# EAGLE design BATT_FLEX11 (EAGLE 9.6.2)
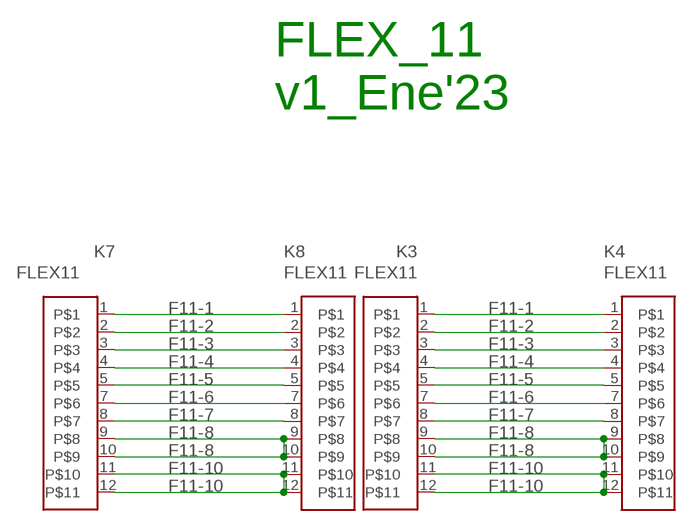
[diagram p0: schematic, sheet 1]

## Parts
K3  FLEX11  [FLEX11]
K4  FLEX11  [FLEX11]
K7  FLEX11  [FLEX11]
K8  FLEX11  [FLEX11]

## Nets
F11-1: K3.1 K4.1 K7.1 K8.1
F11-2: K3.2 K4.2 K7.2 K8.2
F11-3: K3.3 K4.3 K7.3 K8.3
F11-4: K3.4 K4.4 K7.4 K8.4
F11-5: K3.5 K4.5 K7.5 K8.5
F11-6: K3.7 K4.7 K7.7 K8.7
F11-7: K3.8 K4.8 K7.8 K8.8
F11-8: K3.9 K3.10 K4.9 K4.10 K7.9 K7.10 K8.9 K8.10
F11-10: K3.11 K3.12 K4.11 K4.12 K7.11 K7.12 K8.11 K8.12

## Notes on the sheet
- FLEX_11
  v1_Ene'23

## Library data of the parts
K3 K4 K7 K8 = Flex_3mm:FLEX11

## Board
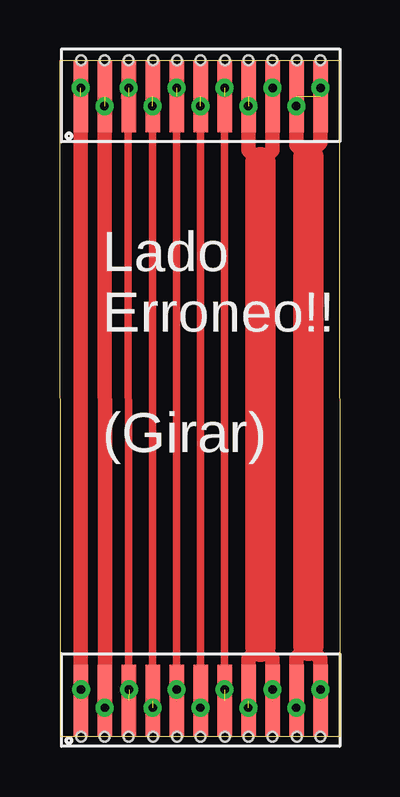
[diagram p1: board, top side]
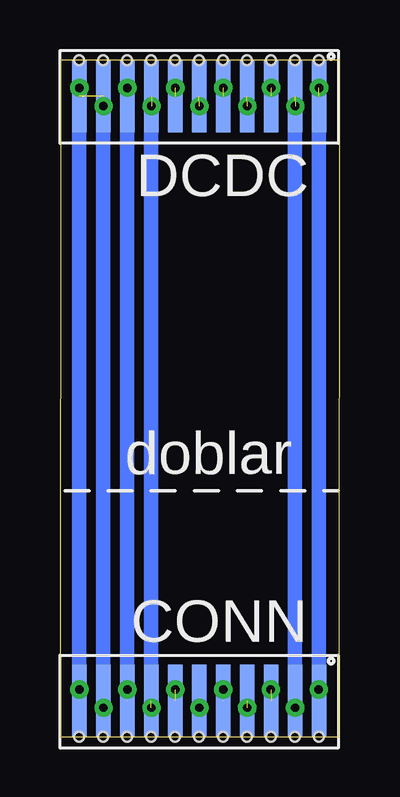
[diagram p2: board, bottom side, seen from below]

Size 11.68 x 28.2 mm. Coordinates in mm from the lower left corner, seen from the top.
Outline: 0,28.2 11.65,28.2 11.68,0 0.03,0 0,28.2
Copper layers (1*16): Top 0.035mm / dielectric 1.5mm / Bottom 0.035mm
Design rules "default *": minimum track width 6mil, minimum drill 0.35mm, track to track 6mil, track to pad 6mil, pad to pad 6mil, via to via 6mil, smd to smd 6mil, copper to edge 8mil, drill to drill 6mil, minimum pad ring 10mil, minimum via ring 8mil, stop-mask expansion 4mil, vias tented up to drill 50mil, thermal gap 10mil
Holes 0.4 mm at 0.88,0.01 1.87,0.01 2.87,0.01 3.88,0.01 4.88,0.01 5.87,0.01 6.88,0.01 7.87,0.01 0.88,28.2 1.87,28.2 2.87,28.2 3.88,28.2 4.88,28.2 5.87,28.2 6.88,28.2 7.87,28.2 8.87,28.2 9.88,28.2 10.87,28.2 8.87,0 9.88,0 10.87,0

### Footprints (pad centres in the part's own frame; a part is rotated, then mirrored left to right if it is on the bottom)
FLEX11 = smd 0.6 x 3: 1 0.8,2.05; 2 1.8,2.05; 3 2.8,2.05; 4 3.8,2.05; 5 4.8,2.05; 7 5.8,2.05; 8 6.8,2.05; 9 7.8,2.05; 10 8.8,2.05; 11 9.8,2.05; 12 10.8,2.05

### Placement (x,y rotation side)
K3  0.07,-0.55 0 top
K4  0.07,24.64 0 top
K7  0.07,28.75 180 bottom
K8  0.07,3.55 180 bottom

### Tracks (layer width: path | path; a pad name or v marks a point on that pad's centre or on a via)
F11-1  (via drill 0.35)  (2 unrouted)
  Top 0.406: K8.1 v0.88,1.97
  Top 0.61: 0.88,1.32 K8.1 K4.1
  Bottom 0.61: K7.1 v0.87,1.98 v0.88,1.97
  other vias: 0.87,27.04
F11-2  (via drill 0.35)  (2 unrouted)
  Top 0.406: K8.2 v1.88,1.22 v1.87,1.21
  Top 0.61: K8.2 K4.2
  Bottom 0.61: K7.2 K8.2
  other vias: 1.86,26.28
F11-3  (via drill 0.35)  (4 unrouted)
  Top 0.305: K8.3 2.85,26.67
  Top 0.61: K8.3 | K4.3 2.85,26.67
  Bottom 0.406: K8.3 | K4.3 K7.3
  other vias: 2.87,27.04 2.88,1.97
F11-4  (via drill 0.35)  (4 unrouted)
  Top 0.305: K4.4 v3.87,1.21
  Top 0.406: K8.4
  other vias: 3.86,26.28
F11-5  (via drill 0.35)  (3 unrouted)
  Top 0.305: K4.5 v4.87,1.97
  Top 0.406: K8.5 v4.87,1.97
  other vias: 4.87,27.04
F11-6  (via drill 0.35)  (3 unrouted)
  Top 0.305: 5.87,1.23 5.88,1.23 | K4.7 K8.7
  Top 0.406: K8.7 5.88,1.23 v5.86,1.21
  Bottom 0.61: v5.87,26.27 v5.86,26.28
F11-7  (via drill 0.35)  (4 unrouted)
  Top 0.305: K8.8 K4.8
  other vias: 6.87,27.04 6.87,1.97
F11-8  (via drill 0.35)  (4 unrouted)
  Top 0.406: v7.87,1.22 v7.86,1.21
  Top 0.61: K4.9 7.87,24.45 8.37,23.95 8.87,24.45 K4.10 | K8.9 7.87,3.25 8.37,3.75 8.87,3.25 K8.10
  Top 1.27: 8.37,3.75 8.37,23.95
  Bottom 0.61: K7.9 K8.9 | K8.10 K7.10
  other vias: 7.86,26.28
F11-10  (4 unrouted)
  Top 0.61: K4.11 9.87,24.65 10.37,24.15 | K3.11 9.87,3.3 10.37,3.8 | K4.12 10.87,24.75 10.37,24.25 | K3.12 10.87,3.25 10.37,3.75
  Top 1.27: 10.37,3.8 10.37,24.15
  Bottom 0.61: K3.11 K7.11 | K7.12 K3.12
F11-12  (via drill 0.35)
  other vias: 8.87,27.04
F11-13  (via drill 0.35)
  other vias: 9.86,26.28
F11-14  (via drill 0.35)
  other vias: 10.87,27.04
F11-15  (via drill 0.35)
  other vias: 8.87,1.97
F11-16  (via drill 0.35)
  other vias: 9.86,1.21
F11-17  (via drill 0.35)
  other vias: 10.87,1.97

### Text on the board
tNames: Lado / Erroneo!! / / (Girar)
bNames: DCDC | doblar | CONN